# Altium schematic sheet 12 GPS,MIPI,EIM.SchDoc
size 513 x 386 mm
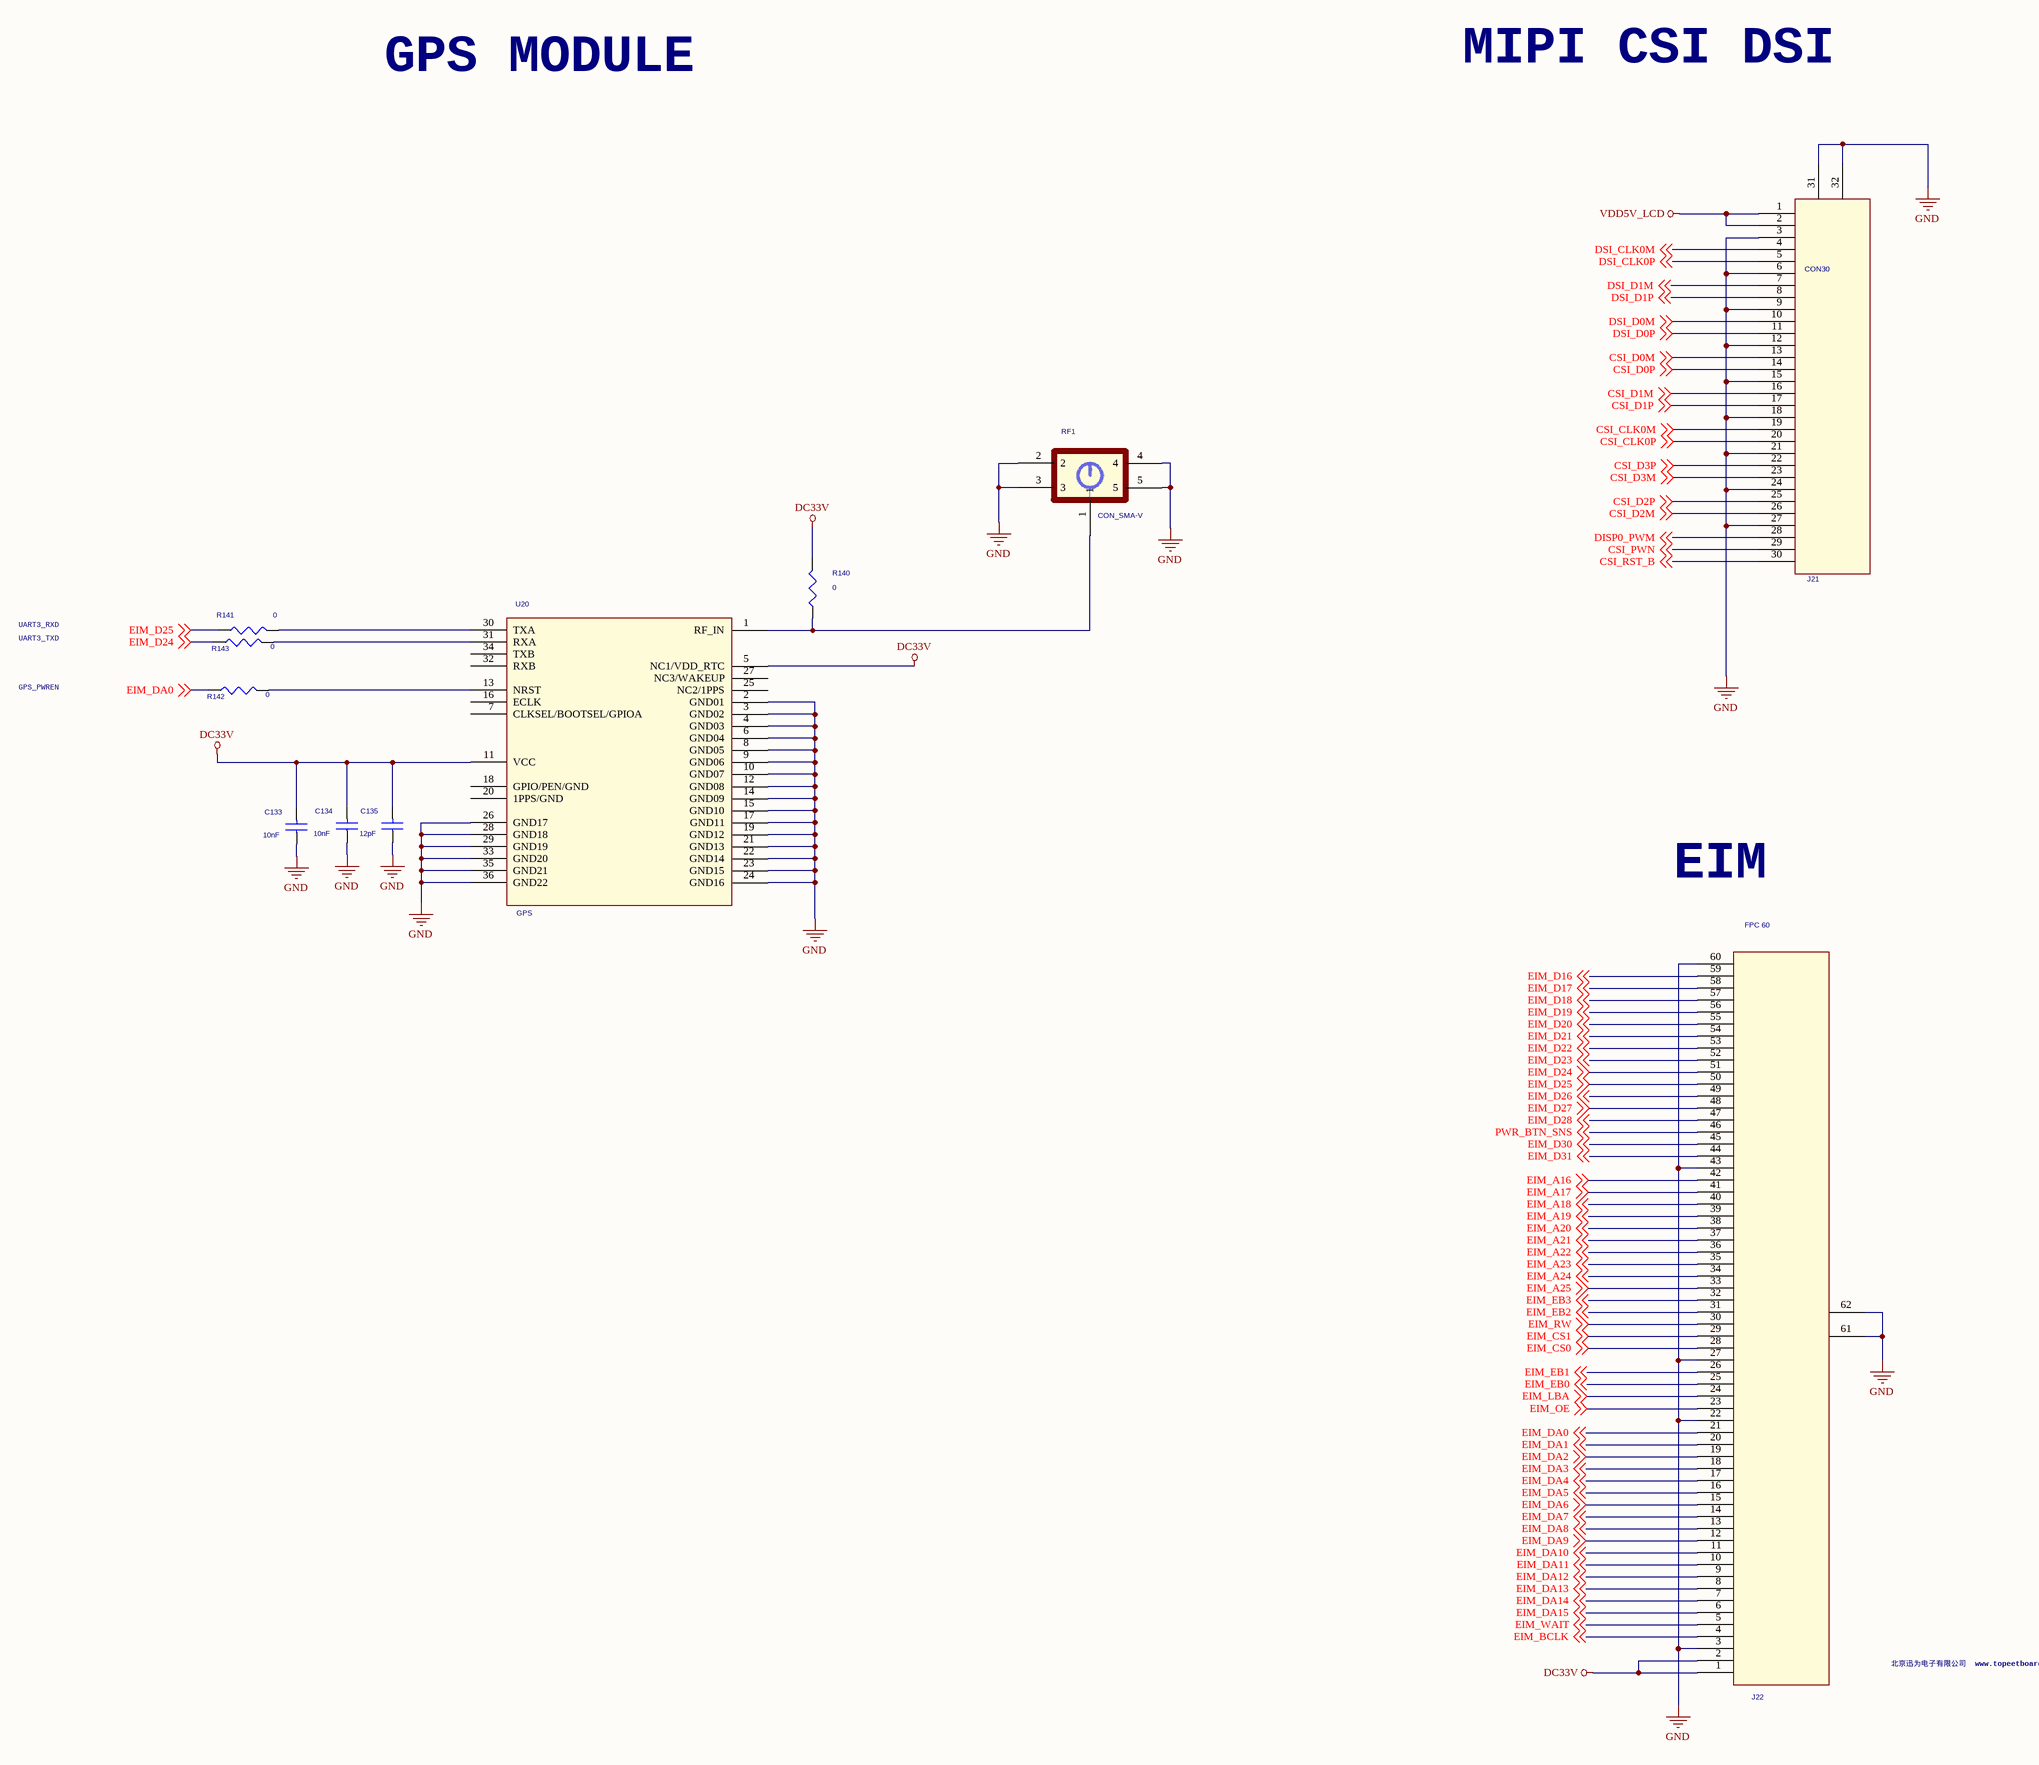
[diagram p0: 12 GPS,MIPI,EIM.SchDoc]

## Parts
C133  10nF  [C1005]
C134  10nF  [C1005]
C135  12pF  [C1005]
J21  CON30  [fpc30-050]
J22  FPC 60  [fpc60-0_5]
R140  0  [R1005]
R141  0  [R1005]
R142  0  [R1005]
R143  0  [R1005]
RF1  CON_SMA-V  [SMA]
U20  GPS  [sm-01]

## Nets
DC33V: C133.2 C134.2 C135.2 J22.1 J22.2 R140.2 U20.5(NC1/VDD_RTC) U20.11(VCC)
GND: C133.1 C134.1 C135.1 J21.3($PIN28) J21.6($PIN25) J21.9($PIN21) J21.12($PIN18) J21.15($PIN15) J21.18($PIN12) J21.21($PIN9) J21.24($PIN6) J21.27($PIN3) J21.31 J21.32 J22.3 J22.22 J22.27 J22.43 J22.60 J22.61 J22.62 RF1.2 RF1.3 RF1.4 RF1.5 U20.2(GND01) U20.3(GND02) U20.4(GND03) U20.6(GND04) U20.8(GND05) U20.9(GND06) U20.10(GND07) U20.12(GND08) U20.14(GND09) U20.15(GND10) U20.17(GND11) U20.19(GND12) U20.21(GND13) U20.22(GND14) U20.23(GND15) U20.24(GND16) U20.26(GND17) U20.28(GND18) U20.29(GND19) U20.33(GND20) U20.35(GND21) U20.36(GND22)
VDD5V_LCD: J21.1($PIN30) J21.2($PIN29)
CSI_CLK0M: J21.19($PIN11) ; off-sheet CSI_CLK0M
CSI_CLK0P: J21.20($PIN10) ; off-sheet CSI_CLK0P
CSI_D0M: J21.13($PIN17) ; off-sheet CSI_D0M
CSI_D0P: J21.14($PIN16) ; off-sheet CSI_D0P
CSI_D1M: J21.16($PIN14) ; off-sheet CSI_D1M
CSI_D1P: J21.17($PIN13) ; off-sheet CSI_D1P
CSI_D2M: J21.26($PIN4) ; off-sheet CSI_D2M
CSI_D2P: J21.25($PIN5) ; off-sheet CSI_D2P
CSI_D3M: J21.23($PIN7) ; off-sheet CSI_D3M
CSI_D3P: J21.22($PIN8) ; off-sheet CSI_D3P
CSI_PWN: J21.29($PIN1) ; off-sheet CSI_PWN
CSI_RST_B: J21.30($PIN0) ; off-sheet CSI_RST_B
DISP0_PWM: J21.28($PIN2) ; off-sheet DISP0_PWM
DSI_CLK0M: J21.4($PIN27) ; off-sheet DSI_CLK0M
DSI_CLK0P: J21.5($PIN26) ; off-sheet DSI_CLK0P
DSI_D0M: J21.10($PIN20) ; off-sheet DSI_D0M
DSI_D0P: J21.11($PIN19) ; off-sheet DSI_D0P
DSI_D1M: J21.7($PIN24) ; off-sheet DSI_D1M
DSI_D1P: J21.8($PIN22) ; off-sheet DSI_D1P
EIM_A16: J22.42 ; off-sheet EIM_A16
EIM_A17: J22.41 ; off-sheet EIM_A17
EIM_A18: J22.40 ; off-sheet EIM_A18
EIM_A19: J22.39 ; off-sheet EIM_A19
EIM_A20: J22.38 ; off-sheet EIM_A20
EIM_A21: J22.37 ; off-sheet EIM_A21
EIM_A22: J22.36 ; off-sheet EIM_A22
EIM_A23: J22.35 ; off-sheet EIM_A23
EIM_A24: J22.34 ; off-sheet EIM_A24
EIM_A25: J22.33 ; off-sheet EIM_A25
EIM_BCLK: J22.4 ; off-sheet EIM_BCLK
EIM_CS0: J22.28 ; off-sheet EIM_CS0
EIM_CS1: J22.29 ; off-sheet EIM_CS1
EIM_D16: J22.59 ; off-sheet EIM_D16
EIM_D17: J22.58 ; off-sheet EIM_D17
EIM_D18: J22.57 ; off-sheet EIM_D18
EIM_D19: J22.56 ; off-sheet EIM_D19
EIM_D20: J22.55 ; off-sheet EIM_D20
EIM_D21: J22.54 ; off-sheet EIM_D21
EIM_D22: J22.53 ; off-sheet EIM_D22
EIM_D23: J22.52 ; off-sheet EIM_D23
EIM_D24: J22.51 R143.1 ; off-sheet EIM_D24
EIM_D25: J22.50 R141.1 ; off-sheet EIM_D25
EIM_D26: J22.49 ; off-sheet EIM_D26
EIM_D27: J22.48 ; off-sheet EIM_D27
EIM_D28: J22.47 ; off-sheet EIM_D28
EIM_D30: J22.45 ; off-sheet EIM_D30
EIM_D31: J22.44 ; off-sheet EIM_D31
EIM_DA0: J22.21 R142.1 ; off-sheet EIM_DA0
EIM_DA1: J22.20 ; off-sheet EIM_DA1
EIM_DA2: J22.19 ; off-sheet EIM_DA2
EIM_DA3: J22.18 ; off-sheet EIM_DA3
EIM_DA4: J22.17 ; off-sheet EIM_DA4
EIM_DA5: J22.16 ; off-sheet EIM_DA5
EIM_DA6: J22.15 ; off-sheet EIM_DA6
EIM_DA7: J22.14 ; off-sheet EIM_DA7
EIM_DA8: J22.13 ; off-sheet EIM_DA8
EIM_DA9: J22.12 ; off-sheet EIM_DA9
EIM_DA10: J22.11 ; off-sheet EIM_DA10
EIM_DA11: J22.10 ; off-sheet EIM_DA11
EIM_DA12: J22.9 ; off-sheet EIM_DA12
EIM_DA13: J22.8 ; off-sheet EIM_DA13
EIM_DA14: J22.7 ; off-sheet EIM_DA14
EIM_DA15: J22.6 ; off-sheet EIM_DA15
EIM_EB0: J22.25 ; off-sheet EIM_EB0
EIM_EB1: J22.26 ; off-sheet EIM_EB1
EIM_EB2: J22.31 ; off-sheet EIM_EB2
EIM_EB3: J22.32 ; off-sheet EIM_EB3
EIM_LBA: J22.24 ; off-sheet EIM_LBA
EIM_OE: J22.23 ; off-sheet EIM_OE
EIM_RW: J22.30 ; off-sheet EIM_RW
EIM_WAIT: J22.5 ; off-sheet EIM_WAIT
PWR_BTN_SNS: J22.46 ; off-sheet PWR_BTN_SNS
NetR140_1: R140.1 RF1.1 U20.1(RF_IN)
NetR141_2: R141.2 U20.30(TXA)
NetR142_2: R142.2 U20.13(NRST)
NetR143_2: R143.2 U20.31(RXA)

Not connected (* = marked no-connect by the designer): U20 7(CLKSEL/BOOTSEL/GPIOA) 16(ECLK) 18(GPIO/PEN/GND) 20(1PPS/GND) 25(NC2/1PPS) 27(NC3/WAKEUP) 32(RXB) 34(TXB)

## Notes on the sheet
- GPS MODULE
- MIPI CSI DSI
- UART3_RXD
- UART3_TXD
- GPS_PWREN
- EIM
- 北京迅为电子有限公司  www.topeetboard.com

## Library data of the parts
C133-C135 = C1005_Dup1
J21 = LVDS_QM_2
J22 = HEADER 60_1
R140-R143 = R1005_0_Dup1
U20 = SM-05